# EAGLE design Zio Qwiic Micropython Pyboard -STM32 V1.3 (EAGLE 9.6.2)
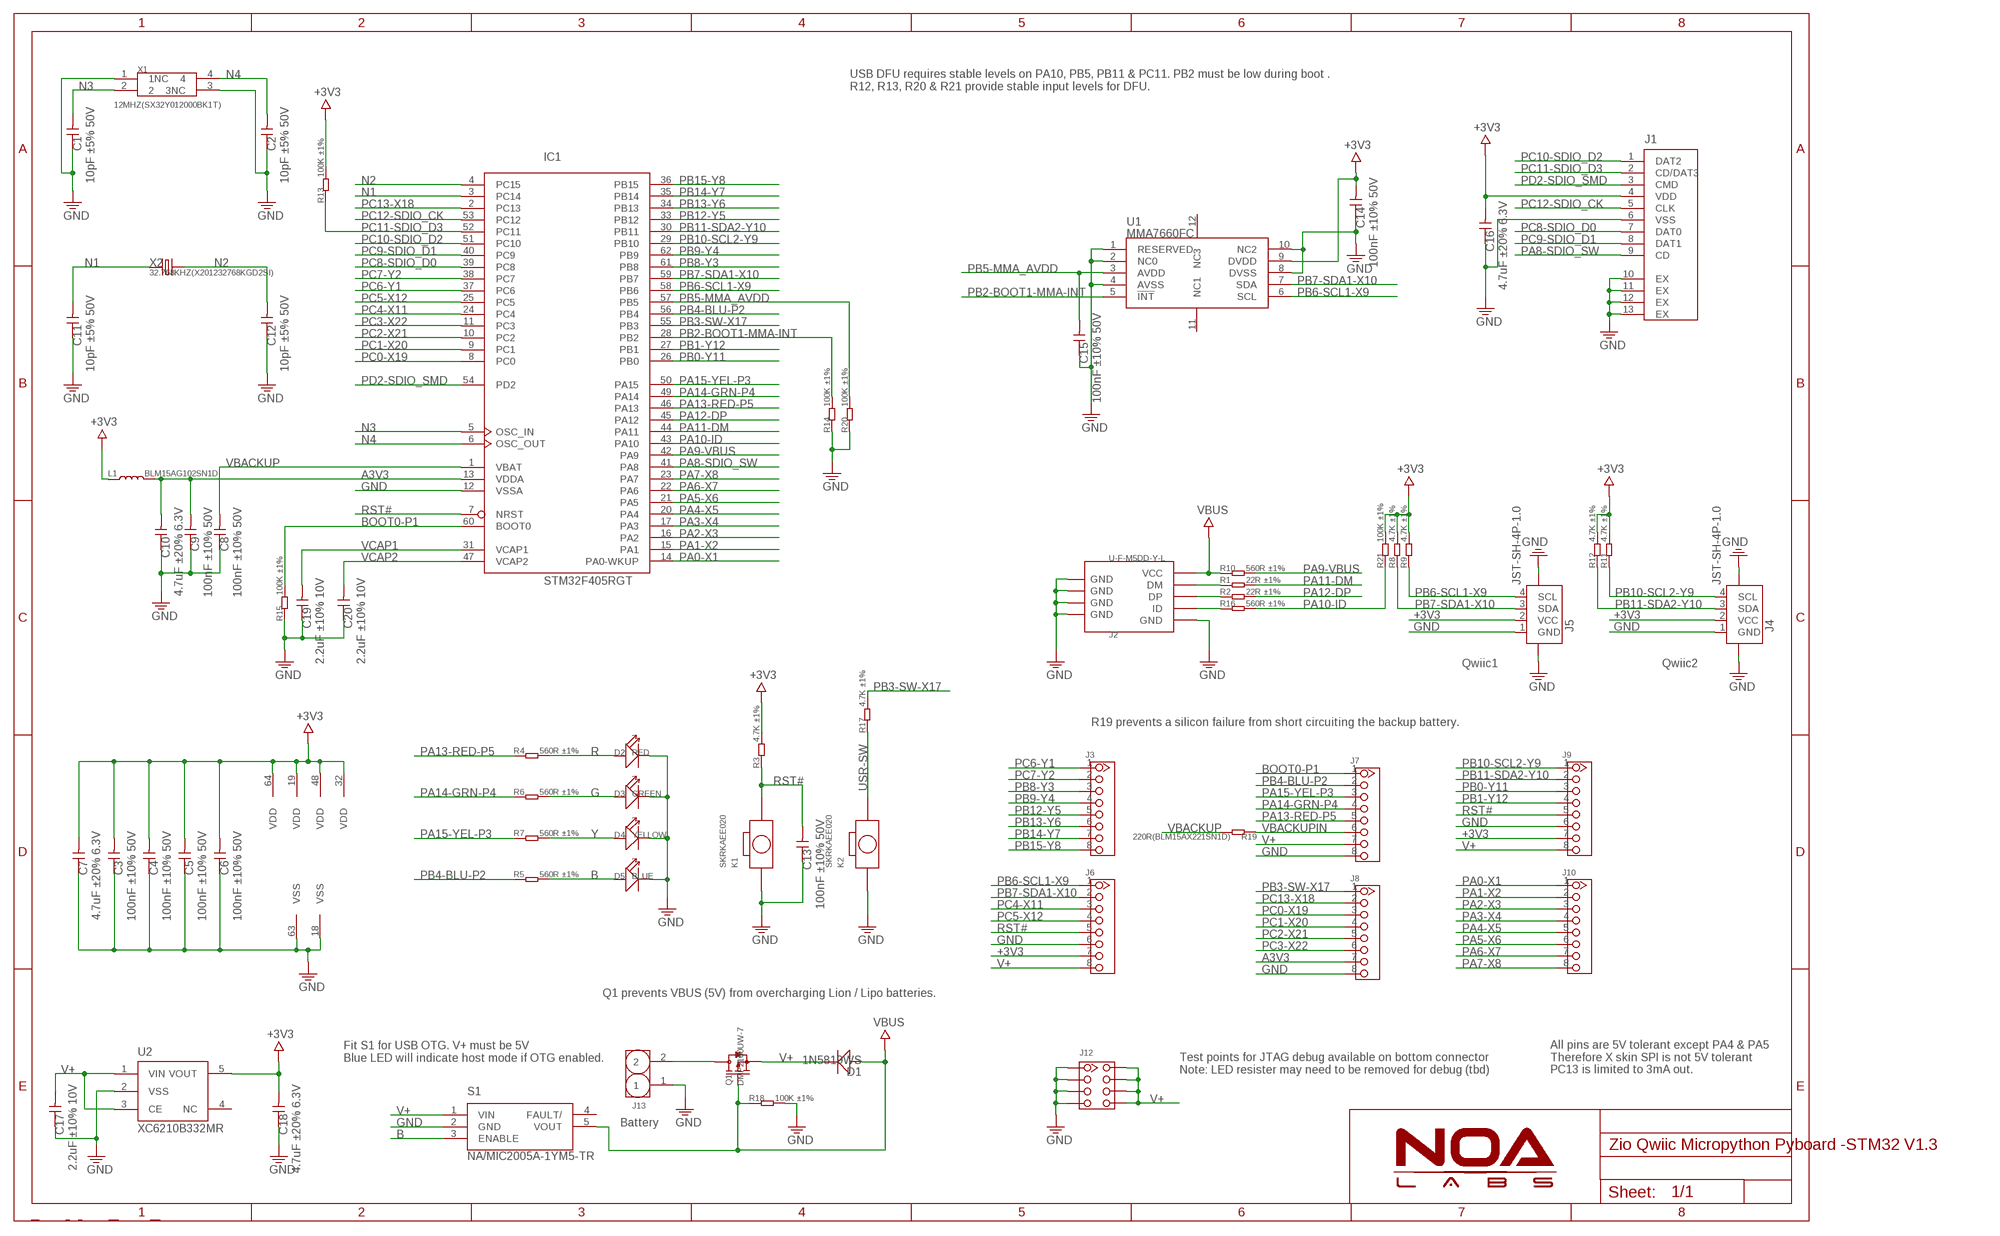
[diagram p0: schematic, sheet 1]

## Parts
C1  10pF ±5% 50V  C-0402  [C0402]
C2  10pF ±5% 50V  C-0402  [C0402]
C3  100nF ±10% 50V  C-0402  [C0402]
C4  100nF ±10% 50V  C-0402  [C0402]
C5  100nF ±10% 50V  C-0402  [C0402]
C6  100nF ±10% 50V  C-0402  [C0402]
C7  4.7uF ±20% 6.3V  C-0402  [C0402]
C8  100nF ±10% 50V  C-0402  [C0402]
C9  100nF ±10% 50V  C-0402  [C0402]
C10  4.7uF ±20% 6.3V  C-0402  [C0402]
C11  10pF ±5% 50V  C-0402  [C0402]
C12  10pF ±5% 50V  C-0402  [C0402]
C13  100nF ±10% 50V  C-0402  [C0402]
C14  100nF ±10% 50V  C-0402  [C0402]
C15  100nF ±10% 50V  C-0402  [C0402]
C16  4.7uF ±20% 6.3V  C-0402  [C0402]
C17  2.2uF ±10% 10V  C-0402  [C0402]
C18  4.7uF ±20% 6.3V  C-0402  [C0402]
C19  2.2uF ±10% 10V  C-0402  [C0402]
C20  2.2uF ±10% 10V  C-0402  [C0402]
D1  1N5819WS  D-0805  [SOD323]
D2  RED  LED'0603'  [LED-0603]
D3  GREEN  LED'0603'  [LED-0603]
D4  YELLOW  LED'0603'  [LED-0603]
D5  BLUE  LED'0603'  [LED-0603]
IC1  STM32F405RGT  [LQFP64]
J1  TF_CARD  [TF_CARD]
J2  U-F-M5DD-Y-L  USB-MICROE  [MICRO-SMD]
J3  HEADER-8P-NS  [8P-2.54-60/35MIL-NS]
J4  JST-SH-4P-1.0  [JST-SH-4P]
J5  JST-SH-4P-1.0  [JST-SH-4P]
J6  HEADER-8P-NS  [8P-2.54-60/35MIL-NS]
J7  HEADER-8P-NS  [8P-2.54-60/35MIL-NS]
J8  HEADER-8P-NS  [8P-2.54-60/35MIL-NS]
J9  HEADER-8P-NS  [8P-2.54-60/35MIL-NS]
J10  HEADER-8P-NS  [8P-2.54-60/35MIL-NS]
J12  HEADER-2X4P-NS  [2X4P-2.54-NS]
J13  HEADER-2P-2.0-90  [PH2.0-2P-90]
K1  SKRKAEE020  BUTTON-2PSKRKAEE020  [SKRKAEE020]
K2  SKRKAEE020  BUTTON-2PSKRKAEE020  [SKRKAEE020]
L1  BLM15AG102SN1D  L-0402  [L0402]
Q1  DMP2160UW-7  MOSFET-P-323  [SOT-323]
R1  22R ±1%  R-0402  [R0402]
R2  22R ±1%  R-0402  [R0402]
R3  4.7K ±1%  R-0402  [R0402]
R4  560R ±1%  R-0402  [R0402]
R5  560R ±1%  R-0402  [R0402]
R6  560R ±1%  R-0402  [R0402]
R7  560R ±1%  R-0402  [R0402]
R8  4.7K ±1%  R-0402  [R0402]
R9  4.7K ±1%  R-0402  [R0402]
R10  560R ±1%  R-0402  [R0402]
R11  4.7K ±1%  R-0402  [R0402]
R12  4.7K ±1%  R-0402  [R0402]
R13  100K ±1%  R-0402  [R0402]
R14  100K ±1%  R-0402  [R0402]
R15  100K ±1%  R-0402  [R0402]
R16  560R ±1%  R-0402  [R0402]
R17  4.7K ±1%  R-0402  [R0402]
R18  100K ±1%  R-0402  [R0402]
R19  220R(BLM15AX221SN1D)  R-0402  [R0402]
R20  100K ±1%  R-0402  [R0402]
R21  100K ±1%  R-0402  [R0402]
S1  NA/MIC2005A-1YM5-TR  MIC2005A-1YM5-TR  [SOT95P280X130-5N]
U1  MMA7660FC  MMA7660FC-DFN10  [DFN10]
U2  XC6210B332MR  XC6210  [SOT23-5]
X1  12MHZ(SX32Y012000BK1T)  CRYSTAL-XTAL-4P-3225  [4P-SMD-3.2X2.5]
X2  32.768KHZ(X201232768KGD2SI)  CRYSTAL-2012  [2.0X12MM]

## Nets
+3V3: C3.2 C4.2 C5.2 C6.2 C7.2 C14.2 C16.2 C18.2 IC1.19(VDD) IC1.32(VDD) IC1.48(VDD) IC1.64(VDD) J1.4(VDD) J4.2(VCC) J5.2(VCC) J6.7 J9.7 L1.1 R3.2 R8.2 R9.2 R11.2 R12.2 R13.2 R21.2 U1.9(DVDD) U2.5(VOUT)
A3V3: C9.2 C10.2 IC1.13(VDDA) J8.7 L1.2
B: D5.+ R5.2 S1.3(ENABLE)
BOOT0-P1: IC1.60(BOOT0) J7.1 R15.2
G: D3.+ R6.2
GND: C1.1 C2.1 C3.1 C4.1 C5.1 C6.1 C7.1 C8.1 C9.1 C10.1 C11.1 C12.1 C13.1 C14.1 C15.1 C16.1 C17.1 C18.1 C19.1 C20.1 D2.- D3.- D4.- D5.- IC1.12(VSSA) IC1.18(VSS) IC1.63(VSS) J1.6(VSS) J1.10(EX) J1.11(EX) J1.12(EX) J1.13(EX) J2.GND J2.S1(GND) J2.S1@1(GND) J2.S1@2(GND) J2.S2(GND) J2.S2@1(GND) J2.S2@2(GND) J2.S3(GND) J2.S3@1(GND) J2.S3@2(GND) J2.S4(GND) J2.S4@1(GND) J2.S4@2(GND) J2.S5(GND) J2.S6(GND) J4.1(GND) J4.NC1 J4.NC2 J5.1(GND) J5.NC1 J5.NC2 J6.6 J7.8 J8.8 J9.6 J12.1 J12.2 J12.3 J12.4 J13.1 K1.1 K2.1 R14.1 R15.1 R18.2 R20.1 S1.2(GND) U1.1(RESERVED) U1.2(NC0) U1.4(AVSS) U1.8(DVSS) U1.10(NC2) U2.2(VSS) X1.1(1NC) X1.3(3NC)
N1: C11.2 IC1.3(PC14) X2.1
N2: C12.2 IC1.4(PC15) X2.2
N3: C1.2 IC1.5(OSC_IN) X1.2
N4: C2.2 IC1.6(OSC_OUT) X1.4
N$2: J2.D-(DM) R1.1
N$3: J2.D+(DP) R2.1
N$4: J2.ID R16.1
N$5: J13.2 Q1.3(D)
PA0-X1: IC1.14(PA0-WKUP) J10.1
PA1-X2: IC1.15(PA1) J10.2
PA2-X3: IC1.16(PA2) J10.3
PA3-X4: IC1.17(PA3) J10.4
PA4-X5: IC1.20(PA4) J10.5
PA5-X6: IC1.21(PA5) J10.6
PA6-X7: IC1.22(PA6) J10.7
PA7-X8: IC1.23(PA7) J10.8
PA8-SDIO_SW: IC1.41(PA8) J1.9(CD)
PA9-VBUS: IC1.42(PA9) R10.2
PA10-ID: IC1.43(PA10) R16.2 R21.1
PA11-DM: IC1.44(PA11) R1.2
PA12-DP: IC1.45(PA12) R2.2
PA13-RED-P5: IC1.46(PA13) J7.5 R4.1
PA14-GRN-P4: IC1.49(PA14) J7.4 R6.1
PA15-YEL-P3: IC1.50(PA15) J7.3 R7.1
PB0-Y11: IC1.26(PB0) J9.3
PB1-Y12: IC1.27(PB1) J9.4
PB2-BOOT1-MMA-INT: IC1.28(PB2) R14.2 U1.5(!INT)
PB3-SW-X17: IC1.55(PB3) J8.1 R17.2
PB4-BLU-P2: IC1.56(PB4) J7.2 R5.1
PB5-MMA_AVDD: C15.2 IC1.57(PB5) R20.2 U1.3(AVDD)
PB6-SCL1-X9: IC1.58(PB6) J5.4(SCL) J6.1 R9.1 U1.6(SCL)
PB7-SDA1-X10: IC1.59(PB7) J5.3(SDA) J6.2 R8.1 U1.7(SDA)
PB8-Y3: IC1.61(PB8) J3.3
PB9-Y4: IC1.62(PB9) J3.4
PB10-SCL2-Y9: IC1.29(PB10) J4.4(SCL) J9.1 R11.1
PB11-SDA2-Y10: IC1.30(PB11) J4.3(SDA) J9.2 R12.1
PB12-Y5: IC1.33(PB12) J3.5
PB13-Y6: IC1.34(PB13) J3.6
PB14-Y7: IC1.35(PB14) J3.7
PB15-Y8: IC1.36(PB15) J3.8
PC0-X19: IC1.8(PC0) J8.3
PC1-X20: IC1.9(PC1) J8.4
PC2-X21: IC1.10(PC2) J8.5
PC3-X22: IC1.11(PC3) J8.6
PC4-X11: IC1.24(PC4) J6.3
PC5-X12: IC1.25(PC5) J6.4
PC6-Y1: IC1.37(PC6) J3.1
PC7-Y2: IC1.38(PC7) J3.2
PC8-SDIO_D0: IC1.39(PC8) J1.7(DAT0)
PC9-SDIO_D1: IC1.40(PC9) J1.8(DAT1)
PC10-SDIO_D2: IC1.51(PC10) J1.1(DAT2)
PC11-SDIO_D3: IC1.52(PC11) J1.2(CD/DAT3) R13.1
PC12-SDIO_CK: IC1.53(PC12) J1.5(CLK)
PC13-X18: IC1.2(PC13) J8.2
PD2-SDIO_SMD: IC1.54(PD2) J1.3(CMD)
R: D2.+ R4.2
RST#: C13.2 IC1.7(NRST) J6.5 J9.5 K1.2 R3.1
USR-SW: K2.2 R17.1
V+: C17.2 D1.- J6.8 J7.7 J9.8 J12.5 J12.6 J12.7 J12.8 Q1.2(S) S1.1(VIN) U2.1(VIN) U2.3(CE)
VBACKUP: C8.2 IC1.1(VBAT) R19.2
VBACKUPIN: J7.6 R19.1
VBUS: D1.+ J2.VBUS(VCC) Q1.1(G) R10.1 R18.1 S1.5(VOUT)
VCAP1: C19.2 IC1.31(VCAP1)
VCAP2: C20.2 IC1.47(VCAP2)
Y: D4.+ R7.2
Unconnected: S1.4(FAULT/) U1.11(NC1) U1.12(NC3) U2.4(NC)

## Notes on the sheet
- USB DFU requires stable levels on PA10, PB5, PB11 & PC11. PB2 must be low during boot .
  R12, R13, R20 & R21 provide stable input levels for DFU.
- Qwiic1 | Qwiic2
- R19 prevents a silicon failure from short circuiting the backup battery.
- Q1 prevents VBUS (5V) from overcharging Lion / Lipo batteries.
- Fit S1 for USB OTG. V+ must be 5V 
  Blue LED will indicate host mode if OTG enabled.
- Test points for JTAG debug available on bottom connector
  Note: LED resister may need to be removed for debug (tbd)
- All pins are 5V tolerant except PA4 & PA5
  Therefore X skin SPI is not 5V tolerant
  PC13 is limited to 3mA out.
- Battery

## Library data of the parts
C1-C20 = RCL:C
D1 = Discrete_NOA:D*
D2-D5 = Discrete_NOA:LED*
IC1 = micro-stm_v3:STM32F405R*T: ARM 32-bit Cortex™-M3 CPU 168 MHz maximum frequency 1024 Kbytes of Flash memory 192 kbytes of SRAM 51 GPIOs 1.8 to 3.6 V application supply
J1 = Connector_NOA:TF_CARD
J2 = Connector_NOA:USB-MICROE
J3 J6-J10 = Connector_NOA:HEADER-8P
J4 J5 = Connector:JST-SH-4P
J12 = Connector_NOA:HEADER-2X4P
J13 = Connector_NOA:HEADER-2P
K1 K2 = Discrete_NOA:BUTTON-2P
L1 = RCL:L
Q1 = Discrete_NOA:MOSFET-P
R1-R21 = RCL:R
S1 = IC_NOA:MIC2005A-1YM5-TR: Micrel MIC2005A-1YM5 TR, USB Power Switch, High Side, 275m, 2.5 V min., 5-Pin SOT-23 Source: Datasheet <http://ww1.microchip.com/downloads/en/DeviceDoc/mic20xx.pdf>; ARROW_PART_NUMBER: MIC2005A-1YM5-TR; ARROW_PRICE-STOCK: https://www.arrow.com/en/products/mic2005a-1ym5-tr/microchip-technology; DESCRIPTION: Micrel MIC2005A-1YM5 TR, USB Power Switch, High Side, 275m, 2.5 V min., 5-Pin SOT-23; HEIGHT: 1.3mm; MANUFACTURER_NAME: Microchip; MANUFACTURER_PART_NUMBER: MIC2005A-1YM5-TR; MOUSER_PART_NUMBER: 998-MIC2005A-1YM5TR; MOUSER_PRICE-STOCK: https://www.mouser.co.uk/ProductDetail/Microchip-Technology-Micrel/MIC2005A-1YM5-TR?qs=Y3Q3JoKAO1So3rAZNWgOKw%3D%3D
U1 = IC_NOA:MMA7660FC: http://search.digikey.com/scripts/DkSearch/dksus.dll?Detail&name=MMA7660FCT-ND
U2 = IC_NOA:XC6210
X1 = Discrete_NOA:CRYSTAL-XTAL-4P
X2 = Discrete_NOA:CRYSTAL*: CRYSTAL

## Board
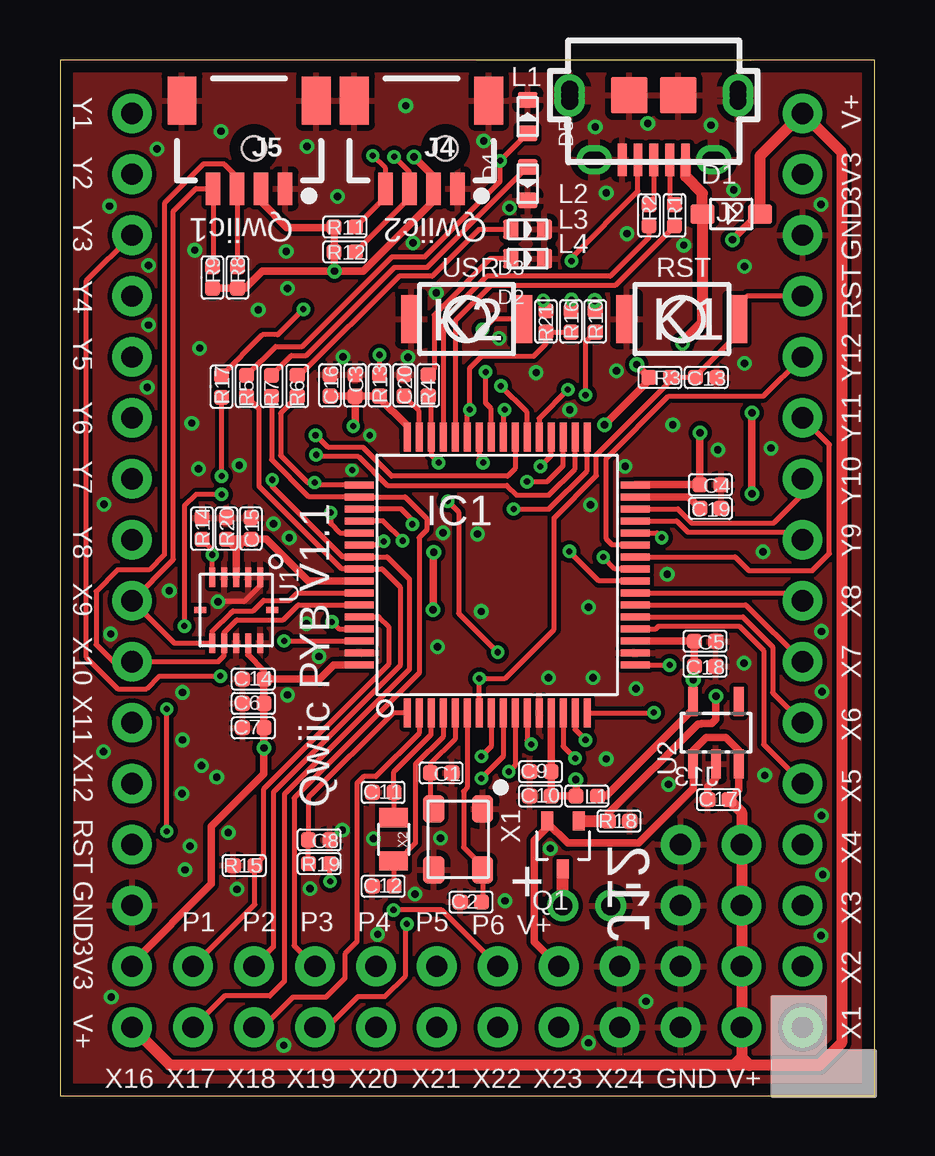
[diagram p1: board, top side]
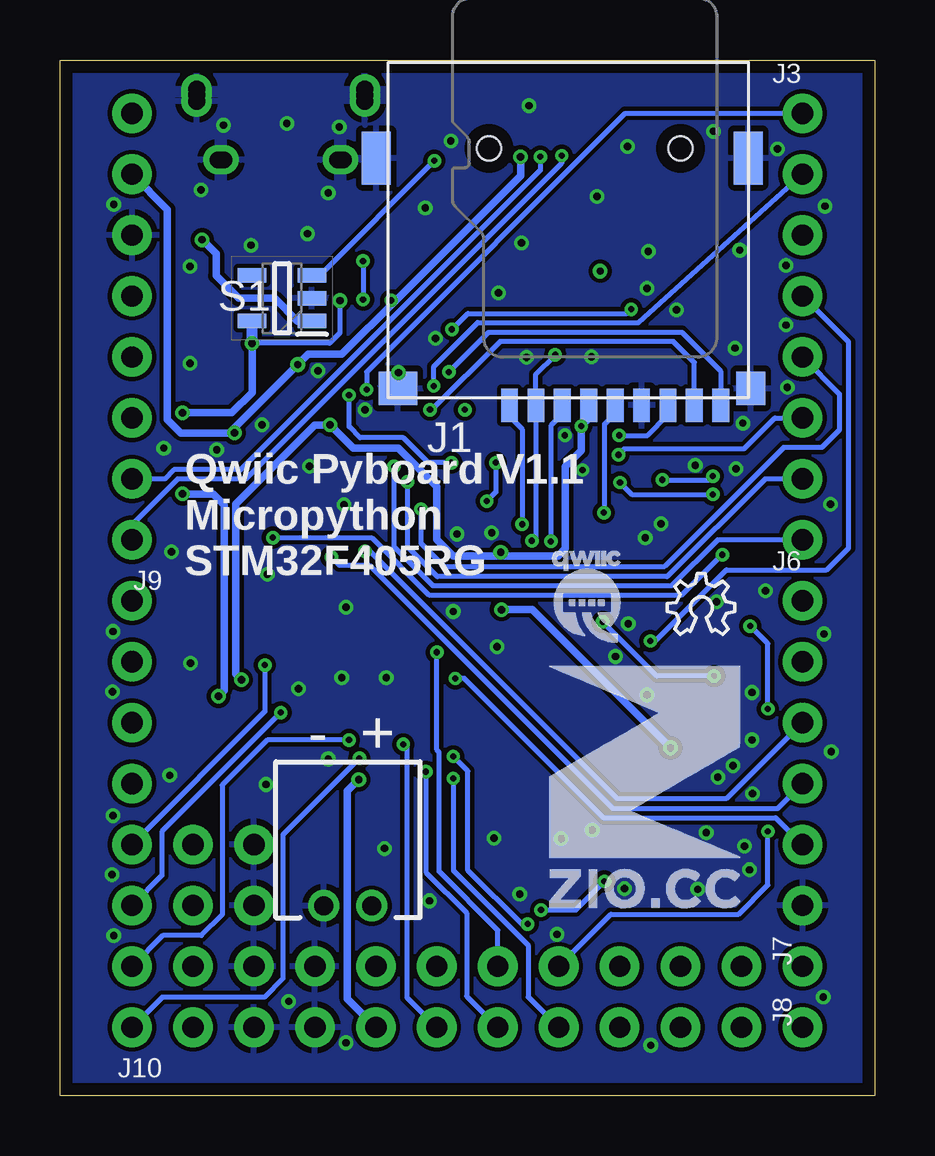
[diagram p2: board, bottom side, seen from below]

Size 33.94 x 43.18 mm. Coordinates in mm from the lower left corner, seen from the top.
Outline: 0,0 33.94,0 33.94,43.18 0,43.18 0,0
Copper layers (1*16): Top 0.035mm / dielectric 1.5mm / Bottom 0.035mm
Design rules "NOA Eagle Rule *": minimum track width 7mil, minimum drill 10mil, track to track 7mil, track to pad 7mil, pad to pad 7mil, via to via 7mil, smd to smd 0mil, copper to edge 20mil, drill to drill 10mil, minimum pad ring 10mil, minimum via ring 6mil, stop-mask expansion 2mil, vias tented up to drill 25mil, thermal gap 10mil

### Footprints (pad centres in the part's own frame; a part is rotated, then mirrored left to right if it is on the bottom)
C0402 = smd 0.635 x 0.635: 1 -0.445,0; 2 0.445,0
SOD323 = smd 1 x 0.8: + -1.2,0; - 1.2,0
LED-0603 = smd 0.635 x 0.8: + 0.699,0; - -0.699,0
LQFP64 = smd 0.3 x 1.2: 1 -3.75,-5.75; 2 -3.25,-5.75; 3 -2.75,-5.75; 4 -2.25,-5.75; 5 -1.75,-5.75; 6 -1.25,-5.75; 7 -0.75,-5.75; 8 -0.25,-5.75; 9 0.25,-5.75; 10 0.75,-5.75; 11 1.25,-5.75; 12 1.75,-5.75; 13 2.25,-5.75; 14 2.75,-5.75; 15 3.25,-5.75; 16 3.75,-5.75; 33 3.75,5.75; 34 3.25,5.75; 35 2.75,5.75; 36 2.25,5.75; 37 1.75,5.75; 38 1.25,5.75; 39 0.75,5.75; 40 0.25,5.75; 41 -0.25,5.75; 42 -0.75,5.75; 43 -1.25,5.75; 44 -1.75,5.75; 45 -2.25,5.75; 46 -2.75,5.75; 47 -3.25,5.75; 48 -3.75,5.75 | smd 1.2 x 0.3: 17 5.75,-3.75; 18 5.75,-3.25; 19 5.75,-2.75; 20 5.75,-2.25; 21 5.75,-1.75; 22 5.75,-1.25; 23 5.75,-0.75; 24 5.75,-0.25; 25 5.75,0.25; 26 5.75,0.75; 27 5.75,1.25; 28 5.75,1.75; 29 5.75,2.25; 30 5.75,2.75; 31 5.75,3.25; 32 5.75,3.75; 49 -5.75,3.75; 50 -5.75,3.25; 51 -5.75,2.75; 52 -5.75,2.25; 53 -5.75,1.75; 54 -5.75,1.25; 55 -5.75,0.75; 56 -5.75,0.25; 57 -5.75,-0.25; 58 -5.75,-0.75; 59 -5.75,-1.25; 60 -5.75,-1.75; 61 -5.75,-2.25; 62 -5.75,-2.75; 63 -5.75,-3.25; 64 -5.75,-3.75
TF_CARD = smd 0.7 x 1.4: 1 9.95,10.3; 2 8.85,10.3; 3 7.75,10.3; 4 6.65,10.3; 5 5.55,10.3; 6 4.45,10.3; 7 3.35,10.3; 8 2.25,10.3; 9 1.15,10.3 | smd 1.2 x 1.4: 10 -0.1,9.6 | smd 1.2 x 2.2: 11 0,0; 12 15.5,0 | smd 1.6 x 1.4: 13 14.6,9.6 | hole 1: 2.82,-0.4; 10.8,-0.4
MICRO-SMD = smd 0.406 x 1.346: D+ 0,2.057; D- -0.66,2.057; GND 1.321,2.057; ID 0.66,2.057; VBUS -1.321,2.057 | drill 0.7: S1 -2.489,2.057; S1@1 -2.616,2.057; S1@2 -2.362,2.057; S2 2.464,2.057; S2@1 2.362,2.057; S2@2 2.616,2.057 | drill 0.7 pad 1.27: S3 -3.505,-0.66; S3@1 -3.505,-0.381; S3@2 -3.505,-0.889; S4 3.505,-0.635; S4@1 3.505,-0.381; S4@2 3.505,-0.889 | smd 1.524 x 1.524: S5 -1.016,-0.635; S6 1.016,-0.635
8P-2.54-60/35MIL-NS = drill 0.889 pad 1.651: 1 0,8.89; 2 0,6.35; 3 0,3.81; 4 0,1.27; 5 0,-1.27; 6 0,-3.81; 7 0,-6.35; 8 0,-8.89
JST-SH-4P = smd 0.6 x 1.35: 1 1.5,0; 2 0.5,0; 3 -0.5,0; 4 -1.5,0 | smd 1.2 x 2: NC1 -2.8,3.675; NC2 2.8,3.675
2X4P-2.54-NS = drill 0.889 pad 1.651: 1 -1.27,3.81; 2 -1.27,1.27; 3 -1.27,-1.27; 4 -1.27,-3.81; 5 1.27,-3.81; 6 1.27,-1.27; 7 1.27,1.27; 8 1.27,3.81
PH2.0-2P-90 = drill 0.8: 1 -1,0; 2 1,0
SKRKAEE020 = smd 0.87 x 2: 1 -2.3,0; 2 2.3,0
L0402 = smd 0.635 x 0.635: 1 -0.445,0; 2 0.445,0
SOT-323 = smd 0.5 x 0.8: 1 0.65,-0.2; 2 -0.65,-0.2; 3 0,-2.2
R0402 = smd 0.635 x 0.635: 1 -0.445,0; 2 0.445,0
SOT95P280X130-5N = smd 1.2 x 0.6: 1 -1.25,0.95; 2 -1.25,0; 3 -1.25,-0.95; 4 1.25,-0.95; 5 1.25,0.95
DFN10 = smd 0.8 x 0.25: 1 -1.375,1; 2 -1.375,0.5; 3 -1.375,0; 4 -1.375,-0.5; 5 -1.375,-1; 6 1.375,-1; 7 1.375,-0.5; 8 1.375,0; 9 1.375,0.5; 10 1.375,1 | smd 0.25 x 0.5: 11 0,-1.5; 12 0,1.5
SOT23-5 = smd 0.4 x 1.2: 1 -0.95,-1.3; 2 0,-1.3; 3 0.95,-1.3; 4 0.95,1.3; 5 -0.95,1.3
4P-SMD-3.2X2.5 = smd 0.889 x 1.143: 1 1.016,1.27; 2 -1.016,1.27; 3 -1.016,-1.27; 4 1.016,-1.27
2.0X12MM = smd 0.8 x 1.2: 1 -0.9,0; 2 0.9,0

### Placement (x,y rotation side)
C1  15.88,13.46 180 top
C2  17.12,8.08 0 top
C3  12.3,29.62 270 top
C4  27.1,25.48 180 top
C5  26.88,18.95 180 top
C6  8.05,16.36 0 top
C7  8.05,15.34 0 top
C8  10.8,10.67 180 top
C9  20.02,13.51 0 top
C10  20.02,12.5 0 top
C11  13.46,12.65 0 top
C12  13.46,8.74 0 top
C13  26.93,29.95 180 top
C14  8.05,17.37 0 top
C15  7.95,23.65 270 top
C16  11.26,29.62 270 top
C17  27.43,12.34 0 top
C18  26.88,17.91 180 top
C19  27.1,24.49 180 top
C20  14.33,29.62 270 top
D1  27.97,36.75 0 top
D2  19.48,34.9 180 top
D3  19.48,36.12 180 top
D4  19.48,38.02 90 top
D5  19.48,40.82 270 top
IC1  18.21,21.72 0 top
J1  5.26,39.09 180 bottom
J2  24.74,41.07 180 top
J3  3,32.07 0 bottom
J4  15.06,37.81 0 top
J5  7.88,37.81 0 top
J6  3,11.75 0 bottom
J7  14.43,5.4 270 bottom
J8  14.43,2.86 270 bottom
J9  30.94,32.07 180 bottom
J10  30.94,11.75 180 bottom
J12  27.13,6.67 180 bottom
J13  21.95,7.92 0 bottom
K1  25.91,32.39 0 top
K2  16.94,32.39 0 top
L1  21.95,12.5 180 top
Q1  20.96,11.66 0 top
R1  25.61,36.7 270 top
R2  24.54,36.7 270 top
R3  25,29.95 180 top
R4  15.34,29.62 90 top
R5  7.78,29.59 90 top
R6  9.88,29.59 90 top
R7  8.82,29.59 90 top
R8  7.39,34.11 270 top
R9  6.35,34.11 270 top
R10  22.3,32.28 270 top
R11  11.86,36.22 180 top
R12  11.86,35.18 180 top
R13  13.31,29.62 270 top
R14  5.92,23.65 270 top
R15  7.67,9.6 0 top
R16  21.29,32.28 270 top
R17  6.73,29.57 270 top
R18  23.29,11.46 0 top
R19  10.8,9.68 180 top
R20  6.94,23.65 270 top
R21  20.25,32.28 90 top
S1  24.69,33.25 180 bottom
U1  7.34,20.24 270 top
U2  27.33,15.14 0 top
U$12  [10MM]  13.57,7.85 0 bottom
U$13  [QWIIC-LOGO-SMALL]  12.07,20.8 0 bottom
U$14  [OSHW_6X100_NOTEXT]  8.64,19.23 0 bottom
X1  16.59,10.69 0 top
X2  13.9,10.69 270 top

### Tracks (layer width: path | path; a pad name or v marks a point on that pad's centre or on a via)
+3V3  (via drill 0.25, 0.3)
  Top 0.203: R21.2 20.25,33.05 v20.14,33.16
  Top 0.254: U1.9 7.84,18.4 8.5,17.74 C14.2
  Top 0.305: IC1.48 14.46,27.93 13.31,29.08 R13.2 C3.2 | C3.2 C16.2 | IC1.32 23.97,25.48 C4.2 26.66,27.62 v26.67,27.64 | L1.1 22.76,12.5 26.38,16.12 U2.5 v26.38,17.35 26.38,17.86 C18.2 C5.2 26.41,18.97 IC1.19 | v12.22,27.92 12.3,27.99 C3.2 | R9.2 R8.2 7.71,33.67 8.42,34.38 v11.42,34.38 | R11.2 11.42,36.2 | 11.42,36.2 R12.2 v11.42,34.38 | 11.42,36.2 9.45,36.2 8.38,37.27 J5.2 | v11.42,34.38 v11.43,34.38 12.63,34.38 15.56,37.32 J4.2 15.56,38.33 v14.75,39.14 | IC1.64 11.42,17.97 10.82,17.37 C14.2 C6.2 C7.2 v8.5,14.5 8.5,13.42 6.3,11.23 6.3,8.83 3,5.52 J6.7 | v24.03,30.48 24.03,30.47 R3.2 24.55,29.83 v22.68,27.96 | v15.55,20.27 15.55,22.63 v15.57,22.66
  Bottom 0.203: v20.14,33.16 19.96,33.16 19.92,33.2
  Bottom 0.305: J1.4 11.91,28.22 v12.22,27.92 12.22,26.9 12.88,26.24 12.88,22.81 13.19,22.5 15.57,22.5 | 15.57,22.5 17.55,22.5 18.24,23.19 18.24,25.4 19.84,27 21.72,27 v22.68,27.96 23.32,27.96 26.61,24.67 26.61,17.58 v26.38,17.35 | v8.5,14.5 14.26,20.27 v15.55,20.27 | v15.57,22.66 15.57,22.5 | v14.75,39.14 14.75,38.37 19.92,33.2 22.2,30.91 23.6,30.91 v24.03,30.48 26.67,27.84 v26.67,27.64 28.91,27.64 29.47,28.19 29.47,36.94 J9.7
A3V3  (via drill 0.3)
  Top 0.305: IC1.13 C9.2 C10.2 L1.2 21.5,13.17 v21.49,13.18
  Bottom 0.305: J8.7 21.96,4.04 21.96,12.71 v21.49,13.18
B  (via drill 0.25)
  Top 0.203: R5.2 8.98,31.24 10.1,31.24 13.83,34.98 15.2,34.98 18.34,38.12 v18.34,38.98 D5.+
  Bottom 0.203: v18.34,38.98 23.12,34.2 S1.3
BOOT0-P1
  Top 0.203: IC1.60 13.28,19.97 13.69,19.56 13.69,17.99 8.47,12.77 8.47,9.96 R15.2 8.12,7.98 J7.1
G
  Top 0.203: D3.+ 17.46,36.12 15.51,34.16 14.12,34.16 10,30.04 R6.2
GND  (via drill 0.25, 0.3)
  Top 0.203: U1.1 8.34,21.27 7.67,20.6 v6.58,20.6
  Top 0.305: U2.2 27.33,13.23 26.99,12.89 C17.1
  other vias: 5.49,28.04 5.77,26.14 4.55,21.06 5.11,16.81 1.81,14.35 5.9,13.77 9.48,16.71 15.73,18.72 22.1,24.64 22.02,20.37 17.4,23.42 28.5,18.03 29.29,22.68 31.73,19.35 22.76,14.05 25.35,12.98 29.37,13.36 5.41,10.41 7.01,10.97 13.24,6.73 13.06,10.72 15.85,10.74 18.54,8.13 8.26,32.77 9.43,35.2 14.4,41.28 28.53,34.57 11.79,30.81 14.51,30.78 19.84,30.15 29.62,27 27.41,26.92 25.3,21.74 20.35,17.42 24.01,16.97 24.49,40.54 17.66,39.8 3.69,34.62 1.83,24.66 7.47,26.29 5.11,14.83 10.42,8.64 14.79,8.41 11.76,11.07 31.75,16.84 28.53,30.53 23.62,35.94 25.99,35.46 28.07,37.77 27.13,40.46 22.3,40.39 11.56,37.49 5.62,35.26 18.72,37.01 4.04,39.47 6.71,40.21 10.29,39.57 15.67,33.48 8.89,23.85 9.55,23.27 10.26,19.68 10.8,18.31 17.55,20.19 20.42,10.31 2.14,4.11 7.37,8.61 5.82,31.17 23.55,26.24 31.78,9.22 5.08,12.6 5.21,9.42 22.2,17.42 9.48,33.66 24.41,3.94 22.02,2.21 12.17,26.09 2.11,19.25 31.73,11.68 31.7,6.68 2.06,37.08 31.7,37.16 23.19,30.23 15.95,23.47 6.53,13.28 12.91,27.53 21.24,28.6 18.29,31.57 14.71,35.56 22.76,37.64 25.53,27.97 3.63,29.54 3.69,32.13 9.32,2.11
  pour Top: 0,43.18 33.94,43.18 33.94,0 0,0
  pour Bottom: 0,43.18 33.94,43.18 33.94,0 0,0
N1
  Top 0.203: IC1.3 15.46,15.05 13.91,13.5 C11.2 13.91,11.61 X2.1
N2
  Top 0.203: IC1.4 15.96,14.97 14.81,13.82 14.81,10.54 14.06,9.79 X2.2 13.9,8.75 C12.2
N3
  Top 0.203: IC1.5 16.46,14.86 15.43,13.83 C1.2 15.43,12.1 X1.2
N4
  Top 0.203: IC1.6 16.96,12.85 16.82,12.7 16.82,10.36 17.6,9.58 X1.4 17.6,8.12 C2.2
N$2
  Top 0.203: J2.D- 25.4,37.35 R1.1
N$3
  Top 0.203: J2.D+ 24.74,37.35 R2.1
N$4  (via drill 0.25)
  Top 0.203: v21.31,33.2 21.29,33.17 R16.1 | v21.31,34.8 21.31,34.95 24.08,37.72 J2.ID
  Bottom 0.203: v21.31,34.8 v21.31,33.2
N$5
  Top 0.508: J13.2 20.95,9.45 Q1.3
PA0-X1  (via drill 0.25)
  Top 0.203: IC1.14 20.96,14.57 v21.47,14.07
  Bottom 0.203: v21.47,14.07 24.65,10.88 24.65,4.89 25.43,4.12 29.68,4.12 J10.1
PA1-X2  (via drill 0.25)
  Top 0.203: IC1.15 21.46,15.27 v21.9,14.83
  Bottom 0.203: v21.9,14.83 25.3,14.83 27.18,12.95 27.18,7.54 28.04,6.68 29.66,6.68 J10.2
PA2-X3  (via drill 0.25)
  Top 0.203: IC1.16 24.73,15.97 v24.74,15.98
  Bottom 0.203: v24.74,15.98 29.7,11.02 29.7,9.18 J10.3
PA3-X4  (via drill 0.25)
  Top 0.203: IC1.17 v25.39,17.97 v25.4,17.96
  Bottom 0.203: v25.4,17.96 25.4,16.02 J10.4
PA4-X5
  Top 0.203: IC1.20 24.83,19.47 24.95,19.58 28.29,19.58 29.31,18.56 29.31,14.64 J10.5
PA5-X6
  Top 0.203: IC1.21 28.45,19.97 29.7,18.72 29.7,16.8 J10.6
PA6-X7
  Top 0.203: IC1.22 28.57,20.47 J10.7
PA7-X8
  Top 0.203: IC1.23 30.61,20.97 J10.8
PA8-SDIO_SW  (via drill 0.25)
  Top 0.203: IC1.41 17.96,28.65 17.73,28.88 v17.73,30.18
  Bottom 0.203: v17.73,30.18 16.08,31.83 8.03,31.83 6.41,30.21 J1.9
PA9-VBUS  (via drill 0.25)
  Top 0.203: IC1.42 17.46,26.56 v17.63,26.39 | v21.9,29.21 21.9,31.43 R10.2
  Bottom 0.203: v17.63,26.39 18.6,26.39 19.64,27.43 21.44,27.43 21.9,27.89 v21.9,29.21
PA10-ID  (via drill 0.25)
  Top 0.203: IC1.43 16.96,28.49 v17.07,28.6 17.07,30.33 17.58,30.84 19.74,30.84 20.25,31.34 R21.1 R16.2
PA11-DM
  Top 0.203: R1.2 23.13,33.78 17.94,33.78 16.46,32.31 IC1.44
PA12-DP
  Top 0.203: R2.2 24.54,35.78 22.93,34.16 17.78,34.16 15.96,32.34 IC1.45
PA13-RED-P5  (via drill 0.25)
  Top 0.203: R4.1 15.46,29.05 IC1.46 15.46,26.7 v15.78,26.39 | v16.16,24.79 16.61,24.33 16.61,20.12 v18.24,18.49
  Bottom 0.203: v16.16,24.79 15.78,25.17 v15.78,26.39 | v18.24,18.49 18.24,14.43 18.14,14.33 18.14,9.35 15.7,6.91 J7.5
PA14-GRN-P4  (via drill 0.25)
  Top 0.203: IC1.49 10.71,25.47 v10.61,25.57 10.33,25.57 9.2,26.7 9.2,28.46 R6.1 | v6.73,25.07 5.67,25.07 5.18,24.59 v5.18,19.58 | v4.45,11.02 v4.45,16.13
  Bottom 0.203: v10.61,25.57 10.11,25.07 v6.73,25.07 | J7.4 10.99,7.57 5.67,7.57 4.45,8.79 v4.45,11.02 | v4.45,16.13 4.45,18.85 v5.18,19.58
PA15-YEL-P3
  Top 0.203: R7.1 8.82,26.52 10.37,24.97 IC1.50 14.38,24.97 15.28,24.07 15.28,23.58 14.96,23.27 14.96,17.62 9.76,12.41 9.76,6.26 J7.3
PB0-Y11
  Top 0.203: IC1.26 28.13,22.47 28.7,21.89 31.35,21.89 32.06,22.61 32.06,27.14 J9.3
PB1-Y12
  Top 0.203: IC1.27 23.01,22.97 22.76,23.22 22.76,26.57 25.35,29.16 29.3,29.16 J9.4
PB2-BOOT1-MMA-INT  (via drill 0.25)
  Top 0.203: U1.5 v6.34,22.55 6.34,22.78 R14.2 | IC1.28 24.87,23.47 v25.07,23.27
  Bottom 0.203: v25.07,23.27 20.96,23.27 18.57,20.88 8.02,20.88 v6.35,22.55 v6.34,22.55
PB3-SW-X17  (via drill 0.25)
  Top 0.203: v8.84,25.68 8.84,25.41 11.78,22.47 IC1.55 13.63,22.47 14.56,21.54 14.56,17.78 9.35,12.57 9.35,4.78 8.74,4.17 6.86,4.17 5.55,2.86 J8.1 | v6.73,25.83 R17.2
  Bottom 0.203: v8.84,25.68 6.89,25.68 v6.73,25.83
PB4-BLU-P2
  Top 0.203: R5.1 8.28,28.64 8.28,25.43 11.74,21.97 IC1.56 13.42,21.97 14.18,21.21 14.18,17.93 8.89,12.65 8.89,6.21 J7.2
PB5-MMA_AVDD
  Top 0.305: IC1.57 10.34,21.47 8.6,23.2 C15.2 7.75,23.2 | 7.75,23.2 7.09,23.2 | 7.09,23.2 R20.2 7.34,22.8 | U1.3 7.34,22.8 | 7.34,22.8 7.75,23.2 | 7.34,22.8 7.34,22.95 7.09,23.2
PB6-SCL1-X9
  Top 0.203: IC1.58 9.89,20.97 9.57,20.65 8.48,20.65 8.05,20.22 7.21,20.22 7.15,20.16 7.13,20.16 6.34,19.37 U1.6 4.77,18.87 J6.1 4.73,22.37 4.73,36.88 5.67,37.82 J5.4 6.38,34.59 R9.1
PB7-SDA1-X10
  Top 0.203: IC1.59 9.93,20.47 9.3,19.84 7.37,19.84 6.84,19.31 U1.7 6.84,18.35 6.59,18.1 J6.2 2.21,18.1 1.5,18.81 1.5,21.03 2.39,21.92 3.71,21.92 4.35,22.55 4.35,37.21 5.97,38.84 6.83,38.84 7.38,38.29 J5.3 7.38,34.58 7.38,34.57 R8.1
PB8-Y3  (via drill 0.25)
  Top 0.203: v11.33,19.76 11.62,19.47 IC1.61 | v6.68,17.5 4.14,17.5 3.61,16.97 2.42,16.97 1.08,18.3 1.08,33.96 J3.3
  Bottom 0.203: v6.68,17.5 9.07,17.5 v11.33,19.76
PB9-Y4  (via drill 0.25)
  Top 0.203: v9.34,18.96 v9.35,18.97 IC1.62
  Bottom 0.203: v9.34,18.96 9.14,18.96 6.17,21.92 2,21.92 1.08,22.84 1.08,31.42 J3.4
PB10-SCL2-Y9  (via drill 0.25)
  Top 0.203: IC1.29 25.69,23.97 26.16,23.5 30.62,23.5 J9.1 | R11.1 13.56,37.48 J4.4 13.56,38.66 v13.03,39.19
  Bottom 0.203: v13.03,39.19 13.03,38.89 26.2,25.72 29.03,25.72 30.94,23.81 J9.1
PB11-SDA2-Y10  (via drill 0.25)
  Top 0.203: IC1.30 25.74,24.47 26.33,23.88 29.73,23.88 30.94,25.08 J9.2 | R12.1 14.56,37.44 J4.3 14.56,38.5 v13.92,39.14
  Bottom 0.203: v13.92,39.14 13.92,38.58 26.41,26.1 29.19,26.1 29.57,25.72 J9.2
PB12-Y5  (via drill 0.25)
  Top 0.203: v18.9,24.46 20.37,24.46 21.96,26.05 IC1.33
  Bottom 0.203: v18.9,24.46 18.9,23.04 17.94,22.07 8.75,22.07 3.79,27.03 2.2,27.03 1.46,27.76 1.46,29.26 J3.5
PB13-Y6  (via drill 0.25)
  Top 0.203: v10.67,26.72 10.75,26.64 12.44,26.64 13.64,25.45 18.62,25.45 19.03,25.04 20.37,25.04 21.46,26.14 IC1.34
  Bottom 0.203: v10.67,26.72 10.42,26.97 5.44,26.97 4.16,28.26 J3.6
PB14-Y7  (via drill 0.25)
  Top 0.203: v19.46,25.6 20.3,25.6 20.96,26.27 IC1.35
  Bottom 0.203: v19.46,25.6 19.46,22.89 18.21,21.64 8.64,21.64 4.56,25.72 J3.7
PB15-Y8  (via drill 0.25)
  Top 0.203: v20.02,26.24 20.46,26.68 IC1.36
  Bottom 0.203: v20.02,26.24 20.02,22.89 18.39,21.26 8.46,21.26 6.54,23.18 J3.8
PC0-X19  (via drill 0.25)
  Top 0.203: IC1.8 17.96,14.56 v17.55,14.15 | J8.3 11.14,2.86 12.42,4.14 13.54,4.14 14.4,5 14.4,7.11 v14.46,7.16
  Bottom 0.203: v14.46,7.16 14.71,7.16 16.95,9.4 16.95,13.54 v17.55,14.15
PC1-X20  (via drill 0.25)
  Top 0.203: IC1.9 18.46,14.14 v17.55,13.23
  Bottom 0.203: v17.55,13.23 17.55,9.4 14.43,6.27 14.43,4.13 J8.4
PC2-X21  (via drill 0.25)
  Top 0.203: IC1.10 18.96,13.78 v18.7,13.51
  Bottom 0.203: v18.7,13.51 18.7,9.32 16.99,7.62 16.99,4.15 J8.5
PC3-X22  (via drill 0.25)
  Top 0.203: IC1.11 19.46,14.83 v19.64,14.66
  Bottom 0.203: v19.64,14.66 19.48,14.5 19.48,4.1 J8.6
PC4-X11  (via drill 0.25)
  Top 0.203: IC1.24 22.45,21.47 v21.22,22.7
  Bottom 0.203: v21.22,22.7 21.02,22.7 10.73,12.41 6.15,12.41 J6.3
PC5-X12  (via drill 0.25)
  Top 0.203: IC1.25 23.12,21.97 v22.63,22.45
  Bottom 0.203: v22.63,22.45 22.3,22.12 21.06,22.12 10.91,11.98 4.04,11.98 J6.4
PC6-Y1  (via drill 0.25)
  Top 0.203: v21.16,29.44 19.96,28.24 IC1.37
  Bottom 0.203: v21.16,29.44 21.16,30.18 10.38,40.96 J3.1
PC7-Y2  (via drill 0.25)
  Top 0.203: IC1.38 19.46,28.49 v18.37,29.59
  Bottom 0.203: J3.2 9.82,32.23 16.54,32.23 18.37,30.4 v18.37,29.59
PC8-SDIO_D0  (via drill 0.25)
  Top 0.203: IC1.39 18.96,26.15 18.65,25.83 13.82,25.83 12.63,27.03 11.18,27.03 10.67,27.53 v10.64,27.53
  Bottom 0.203: J1.7 8.61,28.38 9.45,27.53 v10.64,27.53
PC9-SDIO_D1  (via drill 0.25)
  Top 0.203: v18.52,28.6 18.46,28.54 IC1.40
  Bottom 0.203: J1.8 7.51,30.57 8.38,31.45 15.6,31.45 18.44,28.6 v18.52,28.6
PC10-SDIO_D2  (via drill 0.25)
  Top 0.203: v14.68,23.82 14.68,24 14.22,24.47 IC1.51
  Bottom 0.203: J1.1 15.21,28.31 14.68,27.79 v14.68,23.82
PC11-SDIO_D3  (via drill 0.25)
  Top 0.203: v13.31,30.89 R13.1 | v14.28,23.14 13.45,23.97 IC1.52
  Bottom 0.203: v13.31,30.89 14.11,30.09 J1.2 14.11,23.31 v14.28,23.14
PC12-SDIO_CK  (via drill 0.25)
  Top 0.203: v11.28,24.31 11.28,23.85 11.66,23.47 IC1.53
  Bottom 0.203: J1.5 10.81,28.43 11.26,27.99 11.26,24.33 v11.28,24.31
PC13-X18
  Top 0.203: IC1.2 14.96,15.11 13.16,13.31 12.65,13.31 12.37,13.03 12.37,6.43 11.87,5.92 11.87,4.9 11.08,4.12 9.71,4.12 8.45,2.86 J8.2
PD2-SDIO_SMD  (via drill 0.25)
  Top 0.203: v13.49,23.11 13.34,22.97 IC1.54
  Bottom 0.203: J1.3 13.01,28.42 13.49,27.94 v13.49,23.11
R
  Top 0.203: D2.+ 17.94,34.9 15.58,32.55 15.58,30.3 R4.2
RST#  (via drill 0.25)
  Top 0.203: 25.58,29.95 C13.2 26.48,30.01 28.21,31.74 K1.2 28.21,32.91 28.65,33.35 30.93,33.35 J9.5 | 25.58,29.95 R3.1 | 25.58,29.95 22.39,26.76 22.39,26.75 22.35,26.7 22.35,25.85 20.59,24.09 20.59,19.44 18.55,17.4 v17.47,17.4 v17.46,17.39 IC1.7
  Bottom 0.203: J6.5 4.12,11.59 11.29,11.59 17.09,17.4 v17.47,17.4
USR-SW  (via drill 0.25)
  Top 0.203: K2.2 18.05,32.39 v17.61,31.95 | R17.1 6.73,30.02 8.44,31.72 9.07,31.72 v10.14,32.79
  Bottom 0.203: v17.61,31.95 16.95,32.61 10.31,32.61 v10.14,32.79
V+  (via drill 0.3)
  Top 0.305: C17.2 28.28,12.75 U2.3 28.28,14.39 27.74,14.93 26.93,14.93 26.38,14.39 U2.1 26.38,12.82 24.11,10.54 21.15,10.54 20.31,11.38 | Q1.2 20.31,11.38 | 20.31,11.38 20.31,11.19 19.76,10.64 19.76,6.41 J7.7 | D1.- 29.09,36.75 v28.02,35.69
  Top 0.457: D1.- 29.17,39.19 J9.8 32.57,39.33 32.57,2.21 31.63,1.27 28.73,1.27 | 28.73,1.27 28.07,1.27 | 28.07,1.27 4.59,1.27 J6.8 | C17.2 28.4,11.82 J12.5 J12.6 J12.7 J12.8 28.4,1.6 | 28.4,1.6 28.07,1.27 | 28.4,1.6 28.73,1.27
  Bottom 0.305: S1.1 24.05,32.3 25,33.25 26.49,33.25 27.43,34.19 27.43,35.1 v28.02,35.69
VBACKUP
  Top 0.203: IC1.1 13.89,15.97 10.35,12.43 C8.2 R19.2
VBACKUPIN  (via drill 0.25)
  Top 0.203: J7.6 15.9,7.75 v13.9,7.75 | v11.26,8.94 11.24,8.95 R19.1
  Bottom 0.203: v13.9,7.75 12.45,7.75 v11.26,8.94
VBUS  (via drill 0.3)
  Top 0.203: v22.28,33.15 22.3,33.12 R10.1
  Top 0.305: R18.1 22.85,11.77 26.59,15.51 26.72,15.51 26.73,15.52 27.16,15.52 27.33,15.7 v27.33,16.66 | v28.83,25.09 v28.83,28.47
  Top 0.457: J2.VBUS 26.06,38.33 26.77,37.62 D1.+ 26.77,32.2 v25.94,31.37
  Top 0.508: Q1.1 R18.1
  Bottom 0.203: v22.28,33.15 22.28,31.8 22.71,31.37 v25.94,31.37
  Bottom 0.305: v27.33,16.66 27.1,16.89 27.1,24.64 27.56,25.09 v28.83,25.09 | v28.83,28.47 26.77,28.47 25.94,29.31 v25.94,31.37
  Bottom 0.457: v25.94,31.37 S1.5
VCAP1
  Top 0.305: IC1.31 26.16,24.97 26.3,24.83 26.32,24.83 C19.2
VCAP2
  Top 0.203: IC1.47 14.96,28.54 C20.2
Y
  Top 0.203: R7.2 9.64,30.86 10.26,30.86 13.94,34.54 15.31,34.54 D4.+

### Text on the board
tPlace: Y1 | L1 | V+ | Y2 | 3V3 | Y3 | Qwiic1 | Qwiic2 | L2 | L3 | L4 | GND | Y4 | USR | RST | RST | Y5 | Y12 | Y6 | Y11 | Y7 | Y10 | Y8 | Y9 | X9 | X8 | X10 | X7 | X11 | X12 | X6 | RST | Qwiic PYB V1.1 | X5 | X4 | GND | + | - | 3V3 | P1 | P2 | P3 | P4 | P5 | P6 | V+ | X3 | X2 | V+ | X1 | X16 | X17 | X18 | X19 | X20 | X21 | X22 | X23 | X24 | GND | V+
bPlace: Qwiic Pyboard V1.1 / Micropython / STM32F405RG | + | -